# Altium schematic sheet GSM.SchDoc
size A3
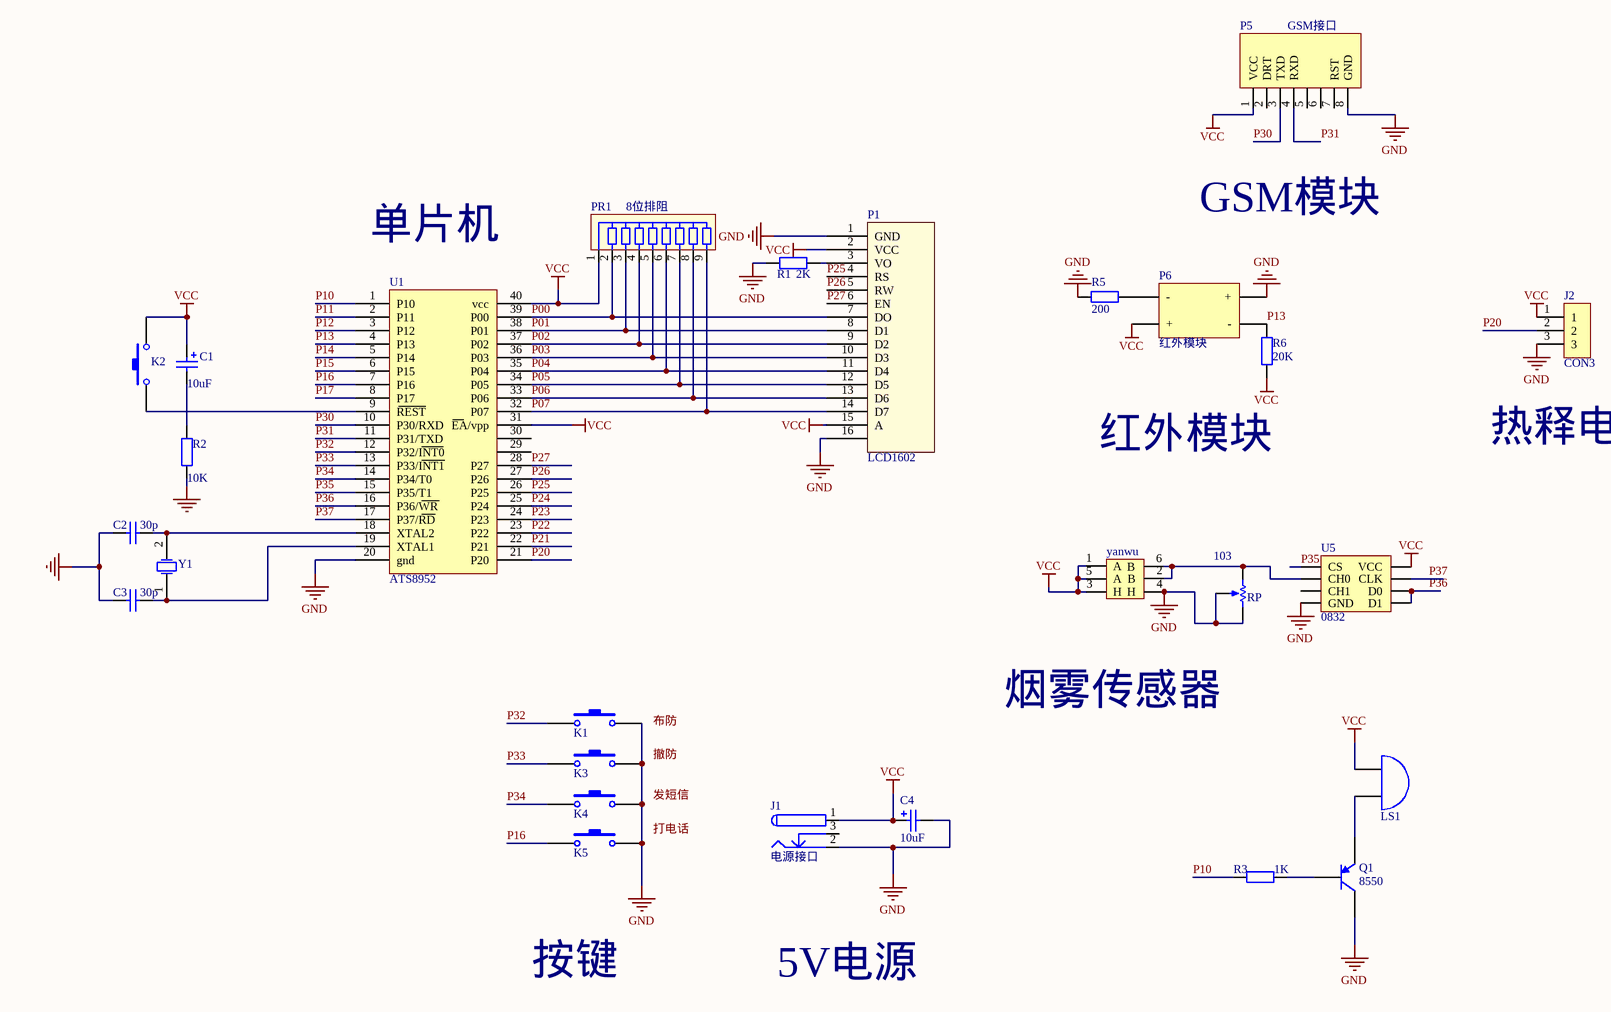
[diagram p0: GSM.SchDoc]

## Parts
C1  10uF  [CD0.254cm-2]
C2  30p  [CAP-100]
C3  30p  [CAP-100]
C4  10uF  [470uF/50V]
J1  电源接口  [DC-JACK]
J2  CON3  [红外热释电]
K1  SW-AJ  [sw-6-6]  (value not drawn)
K2  SW-AJ  [sw-6-6]  (value not drawn)
K3  SW-AJ  [sw-6-6]  (value not drawn)
K4  SW-AJ  [sw-6-6]  (value not drawn)
K5  SW-AJ  [sw-6-6]  (value not drawn)
LS1  Bell  [Buzzy-Small]  (value not drawn)
P1  LCD1602  [1602]
P5  GSM接口  [GSM]
P6  红外模块  [红外对管]
PR1  8位排阻  [HDR1X9]
Q1  8550  [TO-92-2N3906]
R1  2K  [AXIAL-0.3]
R2  10K  [AXIAL-0.3]
R3  1K  [AXIAL-0.3]
R5  200  [AXIAL-0.3]
R6  20K  [AXIAL-0.3]
RP  103  [电位器]
U1  ATS8952  [DIP40]
U5  0832  [DP8]
Y1  XTAL  [XTAL-200]  (value not drawn)
yanwu  烟雾  [烟雾]  (value not drawn)

## Nets
GND: C2.1 C3.1 C4.2 J1.2 J2.3 K1.2 K3.2 K4.2 K5.2 P1.1(GND) P1.16(K) P5.8(GND) P6.4(+) Q1.3(C) R1.1 R2.2 R5.1 RP.2(TAP) RP.3(BOT) U1.20(gnd) U5.4(GND) yanwu.4(H)
VCC: C1.1 C4.1 J1.1 J2.1 K2.2 LS1.1(A) P1.2(VCC) P1.15(A) P5.1(VCC) P6.2(+) PR1.1 R6.1 U1.31(EA/vpp) U1.40(vcc) U5.8(VCC) yanwu.1(A) yanwu.3(H) yanwu.5(A)
P00: P1.7(DO) PR1.2 U1.39(P00)
P01: P1.8(D1) PR1.3 U1.38(P01)
P02: P1.9(D2) PR1.4 U1.37(P02)
P03: P1.10(D3) PR1.5 U1.36(P03)
P04: P1.11(D4) PR1.6 U1.35(P04)
P05: P1.12(D5) PR1.7 U1.34(P05)
P06: P1.13(D6) PR1.8 U1.33(P06)
P07: P1.14(D7) PR1.9 U1.32(P07)
P10: R3.1 U1.1(P10)
P11: U1.2(P11)
P12: U1.3(P12)
P13: P6.3(-) R6.2 U1.4(P13)
P14: U1.5(P14)
P15: U1.6(P15)
P16: K5.1 U1.7(P16)
P17: U1.8(P17)
P20: J2.2 U1.21(P20)
P21: U1.22(P21)
P22: U1.23(P22)
P23: U1.24(P23)
P24: U1.25(P24)
P25: P1.4(RS) U1.26(P25)
P26: P1.5(RW) U1.27(P26)
P27: P1.6(EN) U1.28(P27)
P30: P5.3(TXD) U1.10(P30/RXD)
P31: P5.4(RXD) U1.11(P31/TXD)
P32: K1.1 U1.12(P32/INT0)
P33: K3.1 U1.13(P33/INT1)
P34: K4.1 U1.14(P34/T0)
P35: U1.15(P35/T1) U5.1(CS)
P36: U1.16(P36/WR) U5.5(D1) U5.6(D0)
P37: U1.17(P37/RD) U5.7(CLK)
NetC1_2: C1.2 R2.1
NetC2_2: C2.2 U1.18(XTAL2) Y1.2(OSC2)
NetC3_2: C3.2 U1.19(XTAL1) Y1.1(OSC1)
NetK2_1: K2.1 U1.9(REST)
NetLS1_2: LS1.2(B) Q1.1(E)
NetP1_3: P1.3(VO) R1.2
NetP6_1: P6.1(-) R5.2
NetQ1_2: Q1.2(B) R3.2
NetRP_1: RP.1(TOP) U5.2(CH0) yanwu.2(B) yanwu.6(B)

Not connected (* = marked no-connect by the designer): J1 3; P5 2(DRT) 5 6 7(RST); U1 29 30; U5 3(CH1)

## Notes on the sheet
- GSM模块
- 单片机
- 红外模块
- 热释电
- 烟雾传感器
- 按键
- 5V电源
- Labels drawn without touching a wire or pin: 发短信, 布防, 打电话, 撤防

## Library data of the parts
C1 C4 = C+
C2 C3 = CAP: Value: 33p
J1 = PWR2.5: Low Voltage Power Supply Connector; Published: 17-Dec-2003; DatasheetDocument: 09-May-2002; Publisher: Altium Limited; ComponentLink1Description: Manufacturer Link; ComponentLink1URL: http://domino.kycon.com/internet/Products.html
LS1 = Bell: Electrical Bell; Manufacturer: Generic Components; Published: 1999
PR1 = 8?
Q1 = 2N3906: PNP General Purpose Amplifier; Published: 8-Jun-2000; LatestRevisionDate: 15-Jan-2003; LatestRevisionNote: PCB Footprint 'BCY-W3/D4.7' replaced; DatasheetVersion: 1997; PackageVersion: Sep-1998; PackageReference: TO-92A; Publisher: Altium Limited; PackageDescription: TO, Flat Index; 3 In-Line, Axial Leads; Body Dia. 4.5mm; Leads 0.51 x 0.48 mm (max); ComponentLink1Description: Manufacturer Link; ComponentLink1URL: http://www.fairchildsemi.com/; ComponentLink2Description: Datasheet; ComponentLink2URL: http://www.fairchildsemi.com/ds/2N%2F2N3906.pdf
R1 = Res2: Resistor; Value: 10K; Published: 8-Jun-2000; LatestRevisionDate: 17-Jul-2002; LatestRevisionNote: Re-released for DXP Platform.; PackageReference: AXIAL-0.4; Publisher: Altium Limited
R2 R3 = Res2: Resistor; Published: 8-Jun-2000; LatestRevisionDate: 17-Jul-2002; LatestRevisionNote: Re-released for DXP Platform.; PackageReference: AXIAL-0.4; Publisher: Altium Limited
  R2: Value: 10K
  R3: Value: 1K
R5 R6 = Res2: Resistor; Value: 1K; Published: 8-Jun-2000; LatestRevisionDate: 17-Jul-2002; LatestRevisionNote: Re-released for DXP Platform.; PackageReference: AXIAL-0.4; Publisher: Altium Limited
RP = 电位器
Y1 = XTAL: Crystal Oscillator; Manufacturer: Generic Components; Published: 08/06/2000; Publisher: Altium Hobart Technology Centre; Class: Oscillator; SubClass: Crystal Oscillator